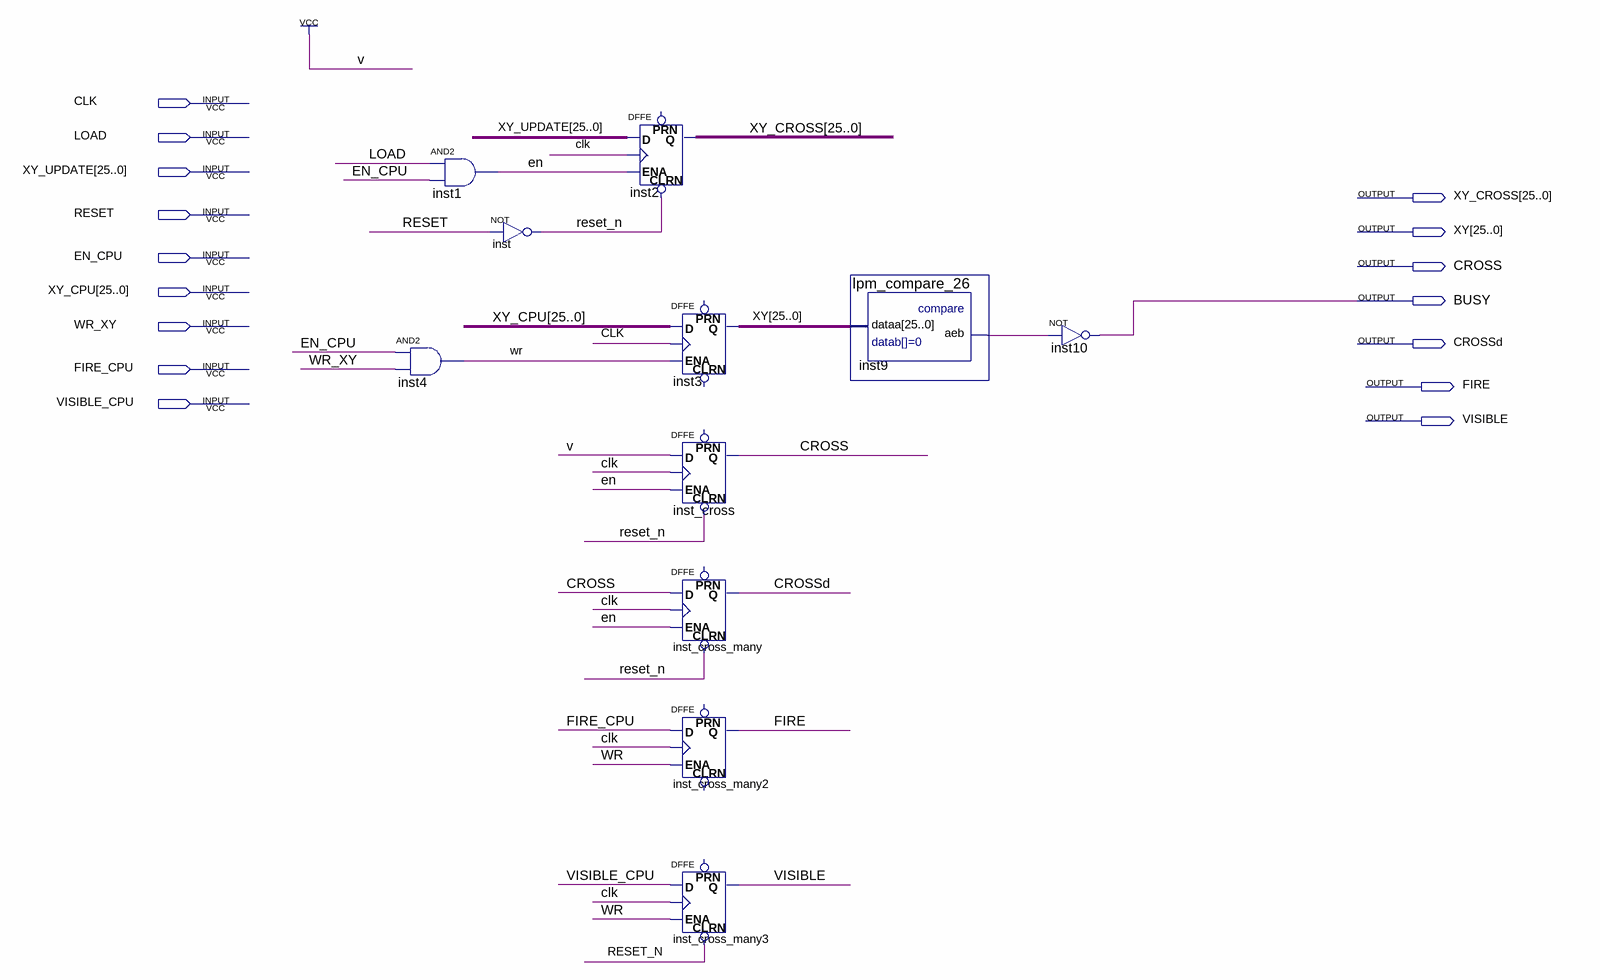
[diagram p0: schematic sheet]
// Quartus schematic HTARGET.bdf as structural Verilog: 11 symbols, 16 pins
module HTARGET (
  input  CLK,
  input  LOAD,
  input  [25:0] XY_UPDATE,
  input  RESET,
  input  EN_CPU,
  input  [25:0] XY_CPU,
  input  WR_XY,
  input  FIRE_CPU,
  input  VISIBLE_CPU,
  output [25:0] XY_CROSS,
  output [25:0] XY,
  output CROSS,
  output BUSY,
  output CROSSd,
  output FIRE,
  output VISIBLE
);

  wire en, inst9_aeb, reset_n, wr;

  and inst1 (en, LOAD, EN_CPU);
  and inst4 (wr, EN_CPU, WR_XY);
  not inst (reset_n, RESET);
  DFFE inst2[25:0] (.CLRN(reset_n), .D(XY_UPDATE), .CLK(CLK), .ENA(en), .Q(XY_CROSS));  // open: PRN
  DFFE inst3[25:0] (.D(XY_CPU), .CLK(CLK), .ENA(wr), .Q(XY));  // open: PRN, CLRN
  DFFE inst_cross (.CLRN(reset_n), .D(1'b1), .CLK(CLK), .ENA(en), .Q(CROSS));  // open: PRN
  DFFE inst_cross_many (.CLRN(reset_n), .D(CROSS), .CLK(CLK), .ENA(en), .Q(CROSSd));  // open: PRN
  DFFE inst_cross_many2 (.D(FIRE_CPU), .CLK(CLK), .ENA(wr), .Q(FIRE));  // open: PRN, CLRN
  DFFE inst_cross_many3 (.CLRN(reset_n), .D(VISIBLE_CPU), .CLK(CLK), .ENA(wr), .Q(VISIBLE));  // open: PRN
  lpm_compare_26 inst9 (.dataa(XY), .aeb(inst9_aeb));
  not inst10 (BUSY, inst9_aeb);
endmodule
